# Altium schematic sheet Sheet_MCU.SchDoc
size A4; SheetNumber: 2; SheetTotal: 5
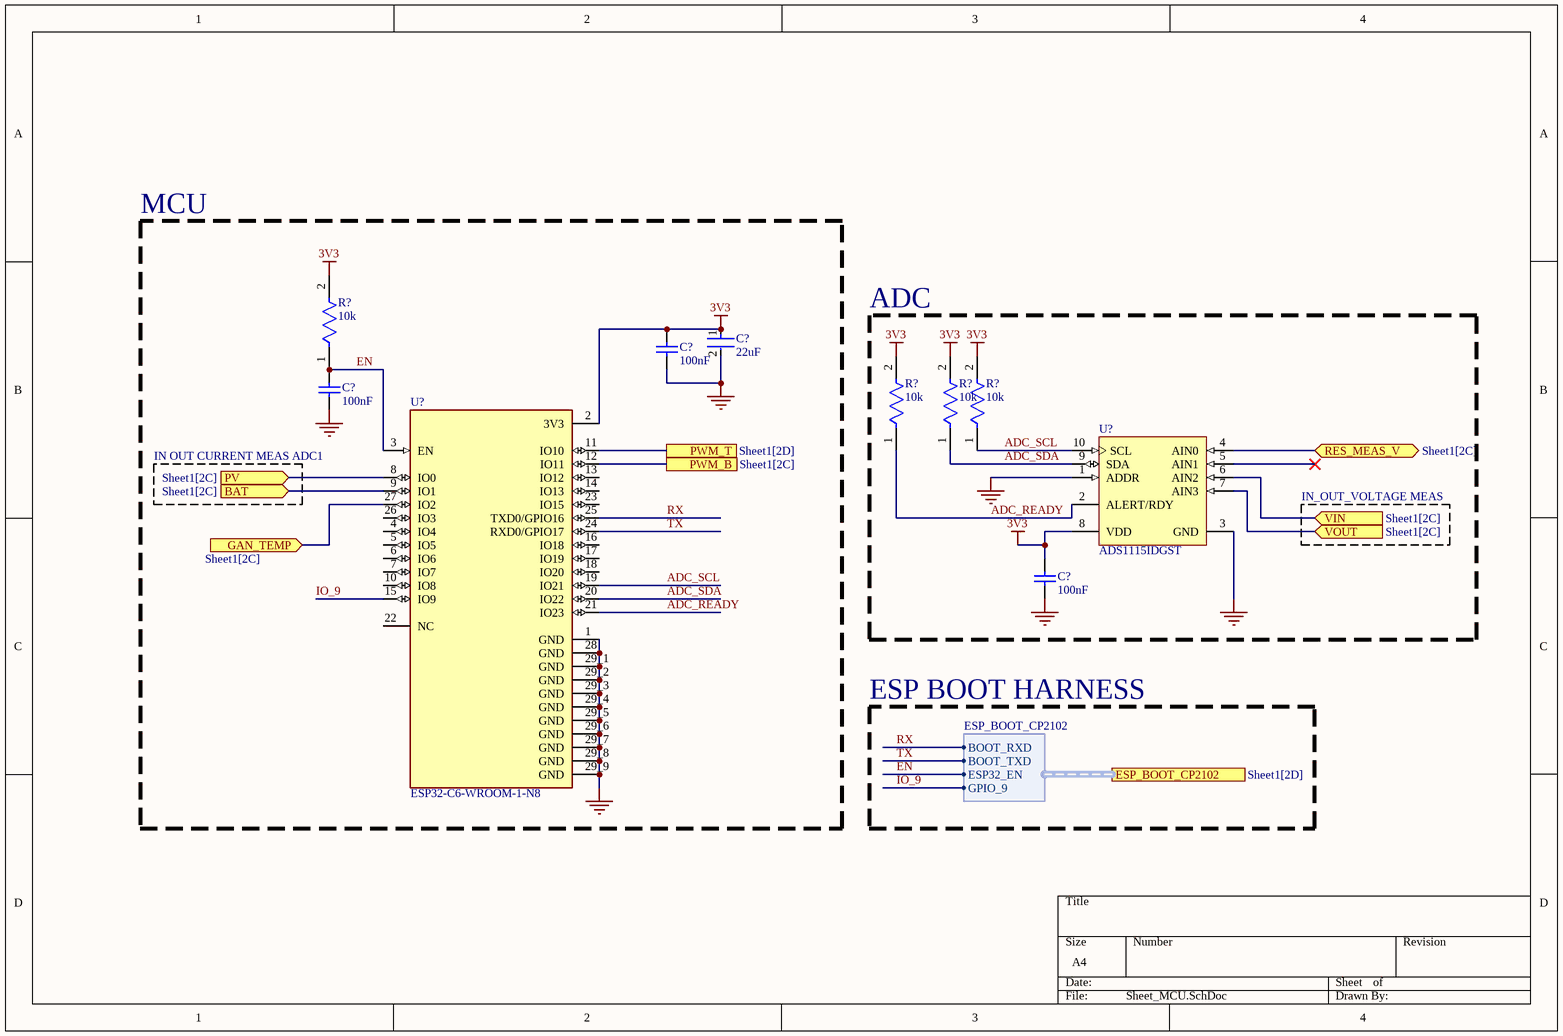
[diagram p0: Sheet_MCU.SchDoc]

## Parts
(Parts that share a designator on the sheet are numbered #1, #2 ... from top to bottom, then left to right.)
C?#1  22uF  [FP-0805-L_2_0_0_2-W_1_25-IPC_A]
C?#2  100nF  [CAPC2013X140X45LL15T25]
C?#3  100nF  [CAPC2013X140X45LL15T25]
C?#4  100nF  [CAPC2013X140X45LL15T25]
R?#1  10k  [FP-RT0805-MFG]
R?#2  10k  [FP-RT0805-MFG]
R?#3  10k  [FP-RT0805-MFG]
R?#4  10k  [FP-RT0805-MFG]
U?#1  ADS1115IDGST  [TI-DGS10_M]
U?#2  ESP32-C6-WROOM-1-N8  [XCVR_ESP32-C6-WROOM-1-N8]

## Blocks framed on the sheet
MCU: C?#1-C?#3 R?#1 U?#2
ADC: C?#4 R?#2-R?#4 U?#1

## Ports
BAT (in, see Sheet1[2C]), ESP_BOOT_CP2102 (harness ESP_BOOT_CP2102, see Sheet1[2D]), GAN_TEMP (in, see Sheet1[2C]), PV (in, see Sheet1[2C]), PWM_B (see Sheet1[2C]), PWM_T (see Sheet1[2D]), RES_MEAS_V (bidir, see Sheet1[2C]), VIN (in, see Sheet1[2C]), VOUT (in, see Sheet1[2C])

## Harnesses
ESP_BOOT_CP2102: BOOT_RXD, BOOT_TXD, ESP32_EN, GPIO_9

## Nets
3V3: C?#1.1 C?#2.2 C?#4.2 R?#1.2 R?#2.2 R?#3.2 R?#4.2 U?#1.8(VDD) U?#2.2(3V3)
GND: C?#1.2 C?#2.1 C?#3.1 C?#4.1 U?#1.1(ADDR) U?#1.3(GND) U?#2.1(GND) U?#2.28(GND) U?#2.29_1(GND) U?#2.29_2(GND) U?#2.29_3(GND) U?#2.29_4(GND) U?#2.29_5(GND) U?#2.29_6(GND) U?#2.29_7(GND) U?#2.29_8(GND) U?#2.29_9(GND)
ADC_READY: R?#2.1 U?#1.2(ALERT/RDY) U?#2.21(IO23)
ADC_SCL: R?#4.1 U?#1.10(SCL) U?#2.19(IO21)
ADC_SDA: R?#3.1 U?#1.9(SDA) U?#2.20(IO22)
BAT: U?#2.9(IO1) ; port BAT
EN: C?#3.2 R?#1.1 U?#2.3(EN) ; port ESP_BOOT_CP2102.ESP32_EN
GAN_TEMP: U?#2.27(IO2) ; port GAN_TEMP
IO_9: U?#2.15(IO9) ; port ESP_BOOT_CP2102.GPIO_9
PV: U?#2.8(IO0) ; port PV
PWM_B: U?#2.12(IO11) ; port PWM_B
PWM_T: U?#2.11(IO10) ; port PWM_T
RES_MEAS_V: U?#1.4(AIN0) ; port RES_MEAS_V
RX: U?#2.25(TXD0/GPIO16) ; port ESP_BOOT_CP2102.BOOT_RXD
TX: U?#2.24(RXD0/GPIO17) ; port ESP_BOOT_CP2102.BOOT_TXD
VIN: U?#1.6(AIN2) ; port VIN
VOUT: U?#1.7(AIN3) ; port VOUT

Not connected (* = marked no-connect by the designer): U?#1 5(AIN1)*; U?#2 4(IO4) 5(IO5) 6(IO6) 7(IO7) 10(IO8) 13(IO12) 14(IO13) 16(IO18) 17(IO19) 18(IO20) 22(NC) 23(IO15) 26(IO3)

## Notes on the sheet
- IN OUT CURRENT MEAS ADC1
- IN_OUT_VOLTAGE MEAS
- ESP BOOT HARNESS

## Library data of the parts
C?#1 = CMP-14477-000140-3: Multilayer Ceramic Capacitor 22uF 16V X5R 20% SMD 0805 T/R; Resistor Type: Ceramic; Packaging: Tape and Reel; Height: 1.25mm; RoHS Compliant: Yes; Case Code (Metric): 2012; Series: M; Dielectric: X5R; Max Operating Temperature: 85°C; Voltage Rating: 16V; Width: 0.039inch; Capacitance: 22uF; Min Operating Temperature: -55°C; Thickness: 0.049inch; Termination: SMD/SMT; Construction: Flat; Voltage Rating (DC): 16V; Package Quantity: 1; Tolerance: 20%; Case Code (Imperial): 0805; Length: 2mm; Mount: Surface Mount; Halogen Free: Halogen Free; Case/Package: 0805
C?#2-C?#4 = CMP-2007-03344-1: Part Number: GCM21BR71E104KA37L; Manufacturer: Murata
R?#1-R?#4 = CMP-03412-013123-1: RES SMD 10K OHM 0.25% 1/8W 0805; Manufacturer Part Number: RT0805CRD0710KL; Manufacturer: Yageo; Value: 10KΩ; Voltage Rating: 150V; Tolerance: 0.005; Power Rating: 0.125W; Temperature Coefficient: 25 ppm/°C; Composition: Thin Film; Device Class L3: Chip SMD Resistors; Automotive: No; ComponentLink2Description: Datasheet; RoHS: TRUE; Temperature Range Low: -55°C; Footprint Url: http://www.yageo.com/exep/pages/download/literatures/PYu-R_Mount_10.pdf; Temperature Range High: +155°C; Digikey Description: RES SMD 10K OHM 0.25% 1/8W 0805; ComponentLink2URL: http://www.yageo.com/documents/recent/PYu-RT_1-to-0.01_RoHS_L_9.pdf; Octopart: https://octopart.com/rt0805crd0710kl-yageo-1253059; Device Class L2: Resistors; Lead Free: Yes; Height: 0.6mm; Temperature: -55°C to +155°C; Resistance: 10KΩ; Series: RT; Ipc Land Pattern Name: RESC200125X50; Category: Res; Device Class L1: Passive Components; Package: RT0805
U?#1 = CMP-0003-00378-2: 16-Bit ADC with Integrated Multiplexer, PGA, Comparator, Oscillator, and Reference, -40 to 125 degC, 10-pin SOP (DGS10), Green (RoHS & no Sb/Br); Manufacturer: Texas Instruments; Sample Rate (max)(SPS): 860; SubFamily: Precision ADC (<=10MSPS); Architecture: Delta-Sigma; Digital Supply(Min)(V): 2; Resolution(Bits): 16; Digital Supply(Max)(V): 5.5; INL(Max)(+/-LSB): 1; Interface: Serial I2C; # Input Channels: 4; Eco-Plan: Green (RoHS & no Sb/Br); PackageDescription: 10-Pin Plastic Small Outline, Body 3 x 3 mm, Pitch 0.5 mm; Mounting Technology: Surface Mount; PackageReference: DGS10; DatasheetVersion: SBAS444B; ComponentLink3Description: Package Specification; ComponentLink1Description: Manufacturer URL; PartNumber: ADS1115IDGST; ComponentLink3URL: http://www.ti.com/lit/ml/mpds035b/mpds035b.pdf; ComponentLink2URL: http://www.ti.com/general/docs/lit/getliterature.tsp?genericPartNumber=ADS1115&fileType=pdf; Analog Voltage AV/DD(Min)(V): 2; ComponentLink2Description: Datasheet; PackageVersion: 4073272/C, 02/2004; Analog Voltage AV/DD(Max)(V): 5.5; Code_JEDEC: MO-153; ComponentLink1URL: http://www.ti.com/
U?#2 = ESP32-C6-WROOM-1-N8: Multiprotocol Modules ESP32-C6 module, Wi-Fi 6 in 2.4 GHz band, Bluetooth 5, Zigbee 3.0 and Thread. ESP34-WROOM Compatible - ENGINEERING SAMPLE; MF: Espressif Systems; SnapEDA_Link: https://www.snapeda.com/parts/ESP32-C6-WROOM-1-N8/Espressif+Systems/view-part/?ref=snap; Package: SMD-28 Espressif Systems; Value: *; MP: ESP32-C6-WROOM-1-N8; Check_prices: https://www.snapeda.com/parts/ESP32-C6-WROOM-1-N8/Espressif+Systems/view-part/?ref=eda